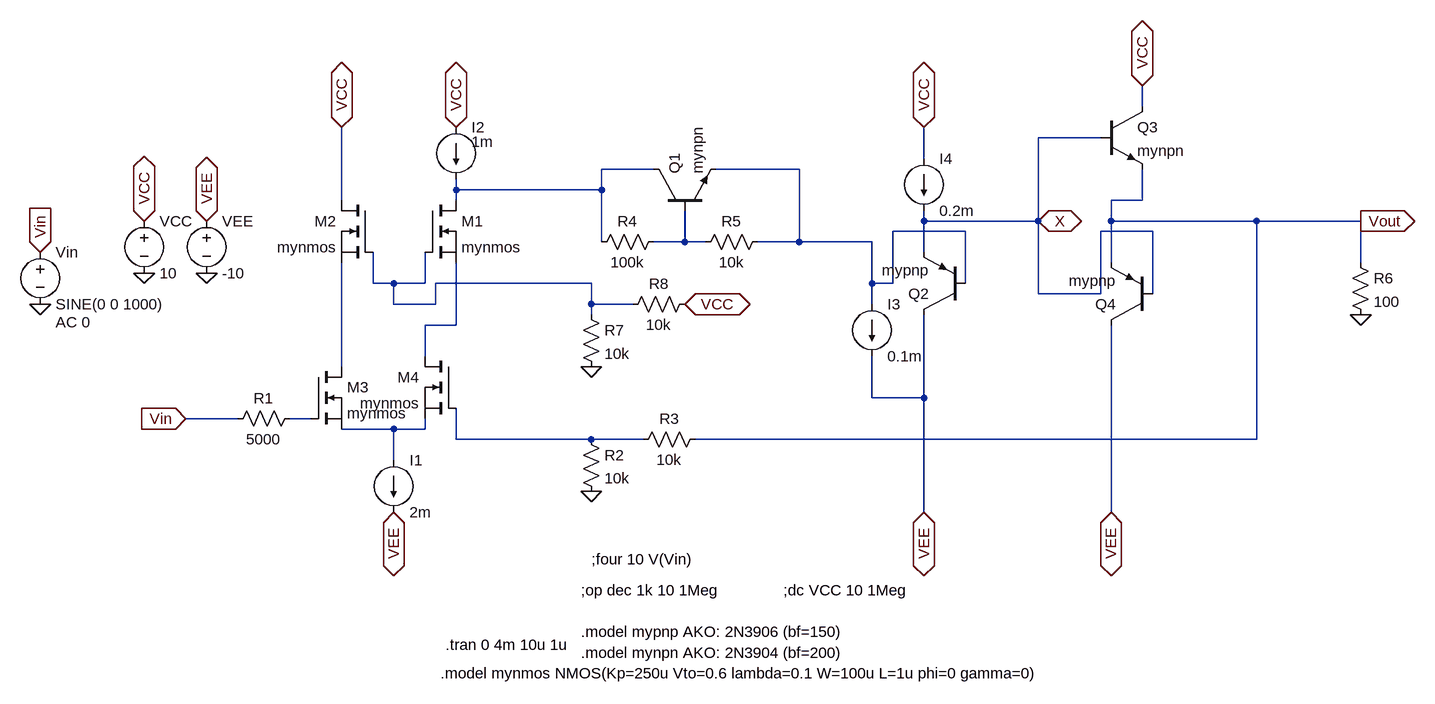
[diagram p0: schematic Electronic2_Project_Phase2_402101577.asc]
Electronic2_Project_Phase2_402101577.asc, the LTspice schematic file:
Version 4
SHEET 1 1792 956
WIRE 1344 48 1344 16
WIRE 1280 96 1184 96
WIRE 1008 128 1008 80
WIRE 592 144 512 144
WIRE 816 144 688 144
WIRE 288 176 288 160
WIRE 512 176 512 144
WIRE 512 176 288 176
WIRE 112 192 112 80
WIRE 288 192 288 176
WIRE 1344 192 1344 144
WIRE 1344 192 1296 192
WIRE 1008 224 1008 208
WIRE 1184 224 1184 96
WIRE 1184 224 1008 224
WIRE 1296 224 1296 192
WIRE 1520 224 1296 224
WIRE 1680 224 1520 224
WIRE 1072 240 960 240
WIRE 1360 240 1280 240
WIRE 512 256 512 176
WIRE 640 256 640 208
WIRE 640 256 592 256
WIRE 672 256 640 256
WIRE 816 256 816 144
WIRE 816 256 752 256
WIRE 928 256 816 256
WIRE 1008 272 1008 224
WIRE 1296 288 1296 224
WIRE 1680 288 1680 224
WIRE 160 320 160 272
WIRE 192 320 160 320
WIRE 240 320 240 272
WIRE 240 320 192 320
WIRE 496 320 256 320
WIRE 928 320 928 256
WIRE 960 320 960 240
WIRE 960 320 928 320
WIRE 1072 320 1072 240
WIRE 1184 336 1184 224
WIRE 1280 336 1280 240
WIRE 1280 336 1184 336
WIRE 1360 336 1360 240
WIRE 192 352 192 320
WIRE 256 352 256 320
WIRE 256 352 192 352
WIRE 496 352 496 320
WIRE 560 352 496 352
WIRE 928 352 928 320
WIRE 496 368 496 352
WIRE 288 384 288 288
WIRE 288 384 240 384
WIRE 240 432 240 384
WIRE 112 448 112 288
WIRE 928 496 928 432
WIRE 1008 496 1008 368
WIRE 1008 496 928 496
WIRE -48 528 -128 528
WIRE 64 528 32 528
WIRE 192 544 112 544
WIRE 240 544 240 528
WIRE 240 544 192 544
WIRE 288 560 288 512
WIRE 496 560 288 560
WIRE 576 560 496 560
WIRE 1520 560 1520 224
WIRE 1520 560 656 560
WIRE 192 592 192 544
WIRE 1008 672 1008 496
WIRE 1296 672 1296 384
FLAG -192 224 VCC
IOPIN -192 224 BiDir
FLAG 112 80 VCC
IOPIN 112 80 BiDir
FLAG 288 80 VCC
IOPIN 288 80 BiDir
FLAG -192 304 0
FLAG -96 304 0
FLAG -352 352 0
FLAG -352 272 Vin
IOPIN -352 272 In
FLAG -128 528 Vin
IOPIN -128 528 In
FLAG -96 224 VEE
IOPIN -96 224 BiDir
FLAG 192 672 VEE
IOPIN 192 672 BiDir
FLAG 496 640 0
FLAG 1008 672 VEE
IOPIN 1008 672 BiDir
FLAG 1008 80 VCC
IOPIN 1008 80 BiDir
FLAG 1296 672 VEE
IOPIN 1296 672 BiDir
FLAG 1344 16 VCC
IOPIN 1344 16 BiDir
FLAG 1680 368 0
FLAG 1680 224 Vout
IOPIN 1680 224 Out
FLAG 640 352 VCC
IOPIN 640 352 BiDir
FLAG 1184 224 X
IOPIN 1184 224 BiDir
FLAG 496 448 0
SYMBOL nmos 240 192 R0
SYMATTR InstName M1
SYMATTR Value mynmos
SYMBOL nmos 160 192 M0
SYMATTR InstName M2
SYMATTR Value mynmos
SYMBOL nmos 64 448 R0
SYMATTR InstName M3
SYMATTR Value mynmos
SYMBOL nmos 288 432 M0
SYMATTR InstName M4
SYMATTR Value mynmos
SYMBOL res 48 512 R90
WINDOW 0 0 56 VBottom 2
WINDOW 3 32 56 VTop 2
SYMATTR InstName R1
SYMATTR Value 5000
SYMBOL voltage -352 256 R0
WINDOW 123 24 124 Left 2
WINDOW 39 0 0 Left 0
SYMATTR InstName Vin
SYMATTR Value SINE(0 0 1000)
SYMATTR Value2 AC 0
SYMBOL voltage -192 208 R0
SYMATTR InstName VCC
SYMATTR Value 10
SYMBOL voltage -96 208 R0
SYMATTR InstName VEE
SYMATTR Value -10
SYMBOL current 288 80 R0
WINDOW 3 24 22 Left 2
WINDOW 123 0 0 Left 0
WINDOW 39 0 0 Left 0
SYMATTR Value 1m
SYMATTR InstName I2
SYMBOL current 192 592 R0
WINDOW 123 0 0 Left 0
WINDOW 39 0 0 Left 0
SYMATTR InstName I1
SYMATTR Value 2m
SYMBOL res 480 544 R0
SYMATTR InstName R2
SYMATTR Value 10k
SYMBOL res 672 544 R90
WINDOW 0 0 56 VBottom 2
WINDOW 3 32 56 VTop 2
SYMATTR InstName R3
SYMATTR Value 10k
SYMBOL res 608 240 R90
WINDOW 0 0 56 VBottom 2
WINDOW 3 32 56 VTop 2
SYMATTR InstName R4
SYMATTR Value 100k
SYMBOL res 768 240 R90
WINDOW 0 0 56 VBottom 2
WINDOW 3 32 56 VTop 2
SYMATTR InstName R5
SYMATTR Value 10k
SYMBOL npn 592 208 R270
SYMATTR InstName Q1
SYMATTR Value mynpn
SYMBOL pnp 1072 368 R180
SYMATTR InstName Q2
SYMATTR Value mypnp
SYMBOL current 928 352 R0
WINDOW 123 0 0 Left 0
WINDOW 39 0 0 Left 0
SYMATTR InstName I3
SYMATTR Value 0.1m
SYMBOL current 1008 128 R0
WINDOW 123 0 0 Left 0
WINDOW 39 0 0 Left 0
SYMATTR InstName I4
SYMATTR Value 0.2m
SYMBOL npn 1280 48 R0
SYMATTR InstName Q3
SYMATTR Value mynpn
SYMBOL pnp 1360 384 R180
SYMATTR InstName Q4
SYMATTR Value mypnp
SYMBOL res 1664 272 R0
SYMATTR InstName R6
SYMATTR Value 100
SYMBOL res 480 352 R0
SYMATTR InstName R7
SYMATTR Value 10k
SYMBOL res 656 336 R90
WINDOW 0 0 56 VBottom 2
WINDOW 3 32 56 VTop 2
SYMATTR InstName R8
SYMATTR Value 10k
TEXT 480 856 Left 2 !.model mypnp AKO: 2N3906 (bf=150)
TEXT 480 888 Left 2 !.model mynpn AKO: 2N3904 (bf=200)
TEXT 264 920 Left 2 !.model mynmos NMOS(Kp=250u Vto=0.6 lambda=0.1 W=100u L=1u phi=0 gamma=0)
TEXT 480 792 Left 2 !;op dec 1k 10 1Meg
TEXT 792 792 Left 2 !;dc VCC 10 1Meg
TEXT 496 744 Left 2 !;four 10 V(Vin)
TEXT 272 876 Left 2 !.tran 0 4m 10u 1u

The netlist it stands for:
* Electronic2_Project_Phase2_402101577.asc
M1 N001 N004 N005 N005 mynmos
M2 VCC N004 N006 N006 mynmos
M3 N006 N007 N008 N008 mynmos
M4 N005 N009 N008 N008 mynmos
R1 N007 Vin 5000
Vin Vin 0 SINE(0 0 1000) AC 0
VCC VCC 0 10
VEE VEE 0 -10
I2 VCC N001 1m
I1 N008 VEE 2m
R2 N009 0 10k
R3 Vout N009 10k
R4 N003 N001 100k
R5 N002 N003 10k
Q1 N001 N003 N002 0 mynpn
Q2 VEE N002 X 0 mypnp
I3 N002 VEE 0.1m
I4 VCC X 0.2m
Q3 VCC X Vout 0 mynpn
Q4 VEE X Vout 0 mypnp
R6 Vout 0 100
R7 N004 0 10k
R8 VCC N004 10k
.model NPN NPN
.model PNP PNP
.lib standard.bjt
.model NMOS NMOS
.model PMOS PMOS
.lib standard.mos
.model mypnp AKO: 2N3906 (bf=150)
.model mynpn AKO: 2N3904 (bf=200)
.model mynmos NMOS(Kp=250u Vto=0.6 lambda=0.1 W=100u L=1u phi=0 gamma=0)
;op dec 1k 10 1Meg
;dc VCC 10 1Meg
;four 10 V(Vin)
.tran 0 4m 10u 1u
.backanno
.end